# Altium project MD029A.PrjPcb (part 3 of 3)

## Sheet MD029A_Hardware.SchDoc
size 431 x 279 mm; Date: Not shown in title block; ApprovedBy: Not shown in title block; CheckedBy: Not shown in title block; Author: Not shown in title block; CompanyName: Not shown in title block; Engineer: Not shown in title block; Organization: Not shown in title block; Address1: Not shown in title block; Address2: Not shown in title block; Address3: Not shown in title block; Address4: Not shown in title block; DocumentNumber: 5; Revision: Use project parameter SCH_Rev; SheetNumber: 5; SheetTotal: 5; PageSetup: Record=PageOptions|CenterHorizontal=True|CenterVertical=True|PrintScale=1.00|XCorrection=1.00|YCorrection=1.00|PrintKind=0|BorderSize=5000000|LeftOffset=0|BottomOffset=0|Orientation=2|PaperLength=1000|PaperWidth=1000|Scale=100|PaperSource=15|PrintQuality=600|MediaType=1|DitherType=10|PaperKind=Letter|PrintScaleMode=1; CurrentTime: Not shown in title block; CurrentDate: Not shown in title block; Time: Not shown in title block; DocumentFullPathAndName: Not shown in title block; DocumentName: Not shown in title block; ModifiedDate: Not shown in title block; ImagePath: Not shown in title block
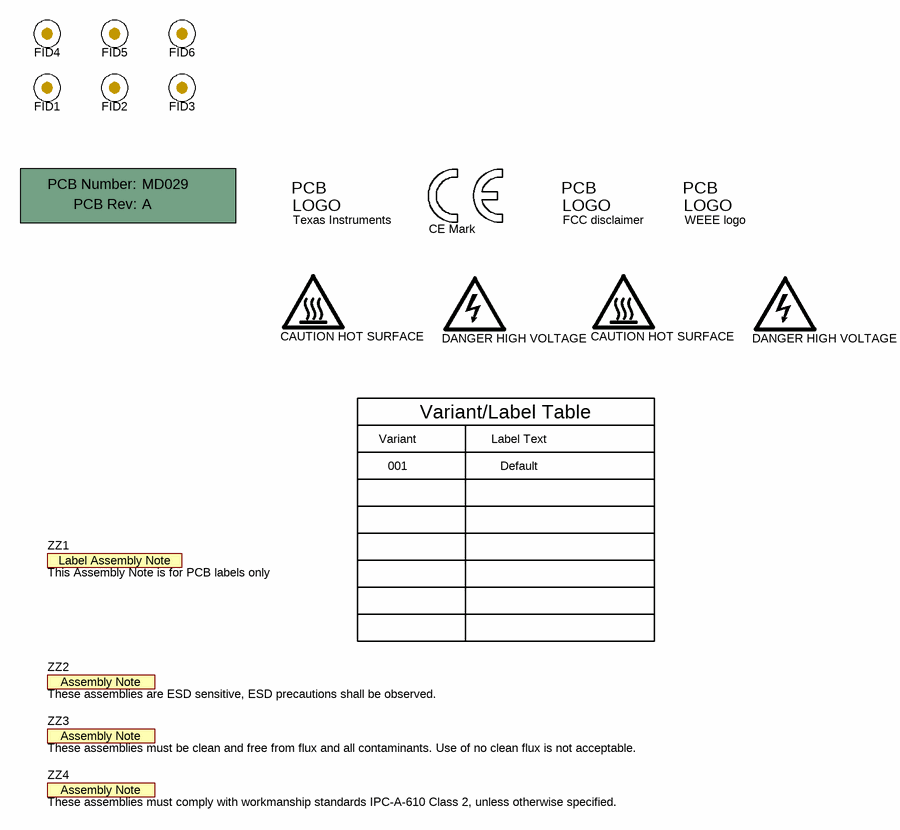
[diagram p4: MD029A_Hardware.SchDoc]

### Parts
!PCB1  Printed Circuit Board  (value not drawn)  (mechanical)
FID1  Fiducial  [Fiducial10-20]  (value not drawn)
FID2  Fiducial  [Fiducial10-20]  (value not drawn)
FID3  Fiducial  [Fiducial10-20]  (value not drawn)
FID4  Fiducial  [Fiducial10-20]  (value not drawn)
FID5  Fiducial  [Fiducial10-20]  (value not drawn)
FID6  Fiducial  [Fiducial10-20]  (value not drawn)
Logo1  CE Mark  [CE_Mark_5mm]  (no BOM)
Logo2  Texas Instruments  [TI_Stacked_Overlay_Small]  (no BOM)
Logo3  FCC disclaimer  [FCC_disclaimer]  (no BOM)
Logo4  WEEE logo  [WEEE_Minimum]  (no BOM)
LOGO5  CAUTION HOT SURFACE  [IEC_HotSurface_Small]  (no BOM)
LOGO6  DANGER HIGH VOLTAGE  [IEC_HighVoltage_Small]  (no BOM)
LOGO7  CAUTION HOT SURFACE  [IEC_HotSurface_Small]  (no BOM)
LOGO8  DANGER HIGH VOLTAGE  [IEC_HighVoltage_Small]  (no BOM)
ZZ1  This Assembly Note is for PCB labels only  [AssemblyNoteLabel]  (no BOM)
ZZ2  These assemblies are ESD sensitive, ESD precautions shall be observed.  [AssemblyNote]  (no BOM)
ZZ3  These assemblies must be clean and free from flux and all contaminants. Use of no clean flux is not acceptable.  [AssemblyNote]  (no BOM)
ZZ4  These assemblies must comply with workmanship standards IPC-A-610 Class 2, unless otherwise specified.  [AssemblyNote]  (no BOM)

### Notes on the sheet
- Variant
- Variant/Label Table
- Label Text
- 001
- Default
- Drawn By:
- SVN Rev:
- Number:
- TID #:
- Orderable:
- Rev:
- Sheet Title:
- File:
- Project Title:
- Designed for:
- Assembly Variant:
- Mod. Date:
- Sheet:
- Size:
- of
- B
- http://www.ti.com
- Texas Instruments and/or its licensors do not warrant the accuracy or completeness of this specification or any information contained therein. Texas Instruments and/or its licensors do not warrant that this design will meet the specifications, will be suitable for your application or fit for any particular purpose, or will operate in an implementation. Texas Instruments and/or its licensors do not warrant that the design is production worthy. You should completely validate and test your design implementation to confirm the system functionality for your application.
- Engineer:
- Contact:
- © Texas Instruments
- (in symbol CMP-0003616-3) Label Assembly Note
- (in symbol CMP-0003618-2) PCB Number:; PCB Rev:
- (in symbol CMP-0074769-1) PCB; LOGO
- (in symbol CMP-0074838-1) PCB; LOGO
- (in symbol CMP-0074847-1) PCB; LOGO

### Library data of the parts
!PCB1 = CMP-0003618-2: Manufacturer: Any; PartNumber: MD029; CompType: PCB; RoHS: O; MountType: N/A; Publisher: Texas Instruments; LatestRevisionDate: 2017-03-09; Key: PCB
FID1-FID6 = CMP-0077181-1: Fiducial mark.  There is nothing to buy or mount.; CompType: Fiducial; Manufacturer: N/A; MountType: N/A; PackageReference: N/A; PartNumber: N/A; ClassName: FiducialMark; Library Reference: Fiducial
Logo1 = CMP-0074844-1: SymbolCreator: a0412235; Published: 2009-03-03; Publisher: Texas Instruments; LatestRevisionDate: 2017-07-06; Lib Reference: CE Mark; PartNumber: CE Mark; Library Reference: CE Mark
Logo2 = CMP-0074838-1: Texas Instrument Corporate Signature; SymbolCreator: a0412235; Lib Reference: TI_Logo; Library Reference: Logo; SymbolVersion: 2011-08-22; Published: 2009-03-03; Publisher: Texas Instruments; ClassName: Logo; LatestRevisionDate: 2017-07-06; PartNumber: Texas Instruments
Logo3 = CMP-0074847-1: FCC_disclaimer; Library Reference: Logo; Published: 2009-03-03; Publisher: Texas Instruments; LatestRevisionDate: 2017-07-06; Lib Reference: FCC_disclaimer; PartNumber: FCC disclaimer
Logo4 = CMP-0074769-1: Library Reference: WEEE logo; Lib Reference: WEEE logo; PartNumber: WEEE logo
LOGO5 LOGO7 = CMP-0074837-1: IEC 61010-1 Hot Surface Warning; SymbolCreator: a0412235; Lib Reference: IEC_HotSurface; SymbolVersion: 2011-08-22; Published: 2009-03-03; Publisher: Texas Instruments; LatestRevisionDate: 2017-07-06; PartNumber: CAUTION HOT SURFACE; Library Reference: IEC_HotSurface
LOGO6 LOGO8 = CMP-0074835-1: IEC 61010-1 High Voltage Warning; SymbolCreator: a0412235; Lib Reference: IEC_HighVoltage; SymbolVersion: 2011-08-22; Published: 2009-03-03; Publisher: Texas Instruments; LatestRevisionDate: 2017-07-06; PartNumber: DANGER HIGH VOLTAGE; Library Reference: IEC_HighVoltage
ZZ1 = CMP-0003616-3: CompType: AssemblyNote; ClassName: AssemblyNote; Publisher: Texas Instruments; LatestRevisionDate: 2017-03-09; Key: AssemblyNoteLabel
ZZ2 = CMP-0077236-1: CompType: AssemblyNote; ClassName: AssemblyNote; Publisher: Texas Instruments; LatestRevisionDate: 2017-08-10; Key: AssemblyNote
ZZ3 = CMP-0077237-1: CompType: AssemblyNote; ClassName: AssemblyNote; Publisher: Texas Instruments; LatestRevisionDate: 2017-08-10; Key: AssemblyNote
ZZ4 = CMP-0077238-1: CompType: AssemblyNote; ClassName: AssemblyNote; Publisher: Texas Instruments; LatestRevisionDate: 2017-08-10; Key: AssemblyNote

## Nets that join several sheets
3.3V: MD029A_DRV8300 (J3.1 R9.1 R10.1 R11.1), MD029A_HalfBridges (C33.1 U6.1), MD029A_CSA (C55.2 J1.1 R64.2 R100.2), MD029A_Power (5 pins)
GND: MD029A_DRV8300 (6 pins), MD029A_HalfBridges (18 pins), MD029A_CSA (24 pins), MD029A_Power (23 pins)
GVDD: MD029A_DRV8300 (7 pins), MD029A_CSA (R86.2), MD029A_Power (GVDD.1)
PVDD: MD029A_HalfBridges (21 pins), MD029A_Power (6 pins)
FAULT: MD029A_CSA (J2.14), MD029A_Power (R14.1)
GHA: MD029A_DRV8300 (U1.19), MD029A_HalfBridges (R27.1 R33.1)
GHB: MD029A_DRV8300 (U1.16), MD029A_HalfBridges (R28.1 R34.1)
GHC: MD029A_DRV8300 (U1.13), MD029A_HalfBridges (R51.1 R54.1)
GLA: MD029A_DRV8300 (U1.11), MD029A_HalfBridges (R39.1 R43.1)
GLB: MD029A_DRV8300 (U1.10), MD029A_HalfBridges (R40.1 R44.1)
GLC: MD029A_DRV8300 (U1.9), MD029A_HalfBridges (R57.1 R59.1)
GVDD_BUCK: MD029A_DRV8300 (J6.1), MD029A_Power (5 pins)
HALL_A: MD029A_DRV8300 (C7.1 J7.2 R11.2), MD029A_CSA (J2.13)
HALL_B: MD029A_DRV8300 (C6.1 J7.3 R10.2), MD029A_CSA (J2.15)
HALL_C: MD029A_DRV8300 (C5.1 J7.4 R9.2), MD029A_CSA (J2.17)
INHA: MD029A_DRV8300 (R5.2 U1.1), MD029A_CSA (J2.1)
INHB: MD029A_DRV8300 (R6.2 U1.2), MD029A_CSA (J2.5)
INHC: MD029A_DRV8300 (R8.2 U1.3), MD029A_CSA (J2.9)
INLA: MD029A_DRV8300 (R5.1 U1.4), MD029A_CSA (J2.3)
INLB: MD029A_DRV8300 (R6.1 U1.5), MD029A_CSA (J2.7)
INLC: MD029A_DRV8300 (R8.1 U1.6), MD029A_CSA (J2.11)
SEN_GVDD: MD029A_CSA (C49.2 J1.20 R86.1 R91.2), MD029A_Power (U4.1)
SEN_PVDD: MD029A_CSA (J1.12), MD029A_Power (C10.2 R12.1 R13.2 U5.4)
SHA: MD029A_DRV8300 (C1.1 U1.18), MD029A_HalfBridges (R37.1), MD029A_CSA (R74.2)
SHB: MD029A_DRV8300 (C2.1 U1.15), MD029A_HalfBridges (R38.1), MD029A_CSA (R75.2)
SHC: MD029A_DRV8300 (C3.1 U1.12), MD029A_HalfBridges (R56.1), MD029A_CSA (R76.2)
SNA: MD029A_HalfBridges (NT3.1), MD029A_CSA (C39.2 R69.1)
SNB: MD029A_HalfBridges (NT4.1), MD029A_CSA (C42.2 R78.1)
SNC: MD029A_HalfBridges (NT6.1), MD029A_CSA (C48.2 R95.1)
SPA: MD029A_HalfBridges (NT1.1), MD029A_CSA (C41.1 R71.1)
SPB: MD029A_HalfBridges (NT2.1), MD029A_CSA (C47.1 R83.1)
SPC: MD029A_HalfBridges (NT5.1), MD029A_CSA (C54.1 R97.1)
TEMP: MD029A_HalfBridges (C34.1 R60.1), MD029A_CSA (J1.9)
VSENA: MD029A_CSA (C43.2 J1.6 R74.1 R80.2), MD029A_Power (U5.1)
VSENB: MD029A_CSA (C44.2 J1.8 R75.1 R81.2), MD029A_Power (U5.6)
VSENC: MD029A_CSA (C45.2 J1.10 R76.1 R82.2), MD029A_Power (U5.3)

## Assembly variants
001: not fitted C20 C21 C22 C23 C24 C25 C26 C27 C29 C30 C31 C32 D1 D2 D3 D8 D9 D12 D13 D16 D18 FID1 FID2 FID3 FID4 FID5 FID6 R1 R2 R3 R5 R6 R8 R27 R27 R28 R28 R29 R30 R39 R39 R40 R40 R47 R48 R51 R51 R52 R57 R57 R62